# EAGLE design o18_irTransmitter-v03(3_3) (EAGLE 6.6.0)
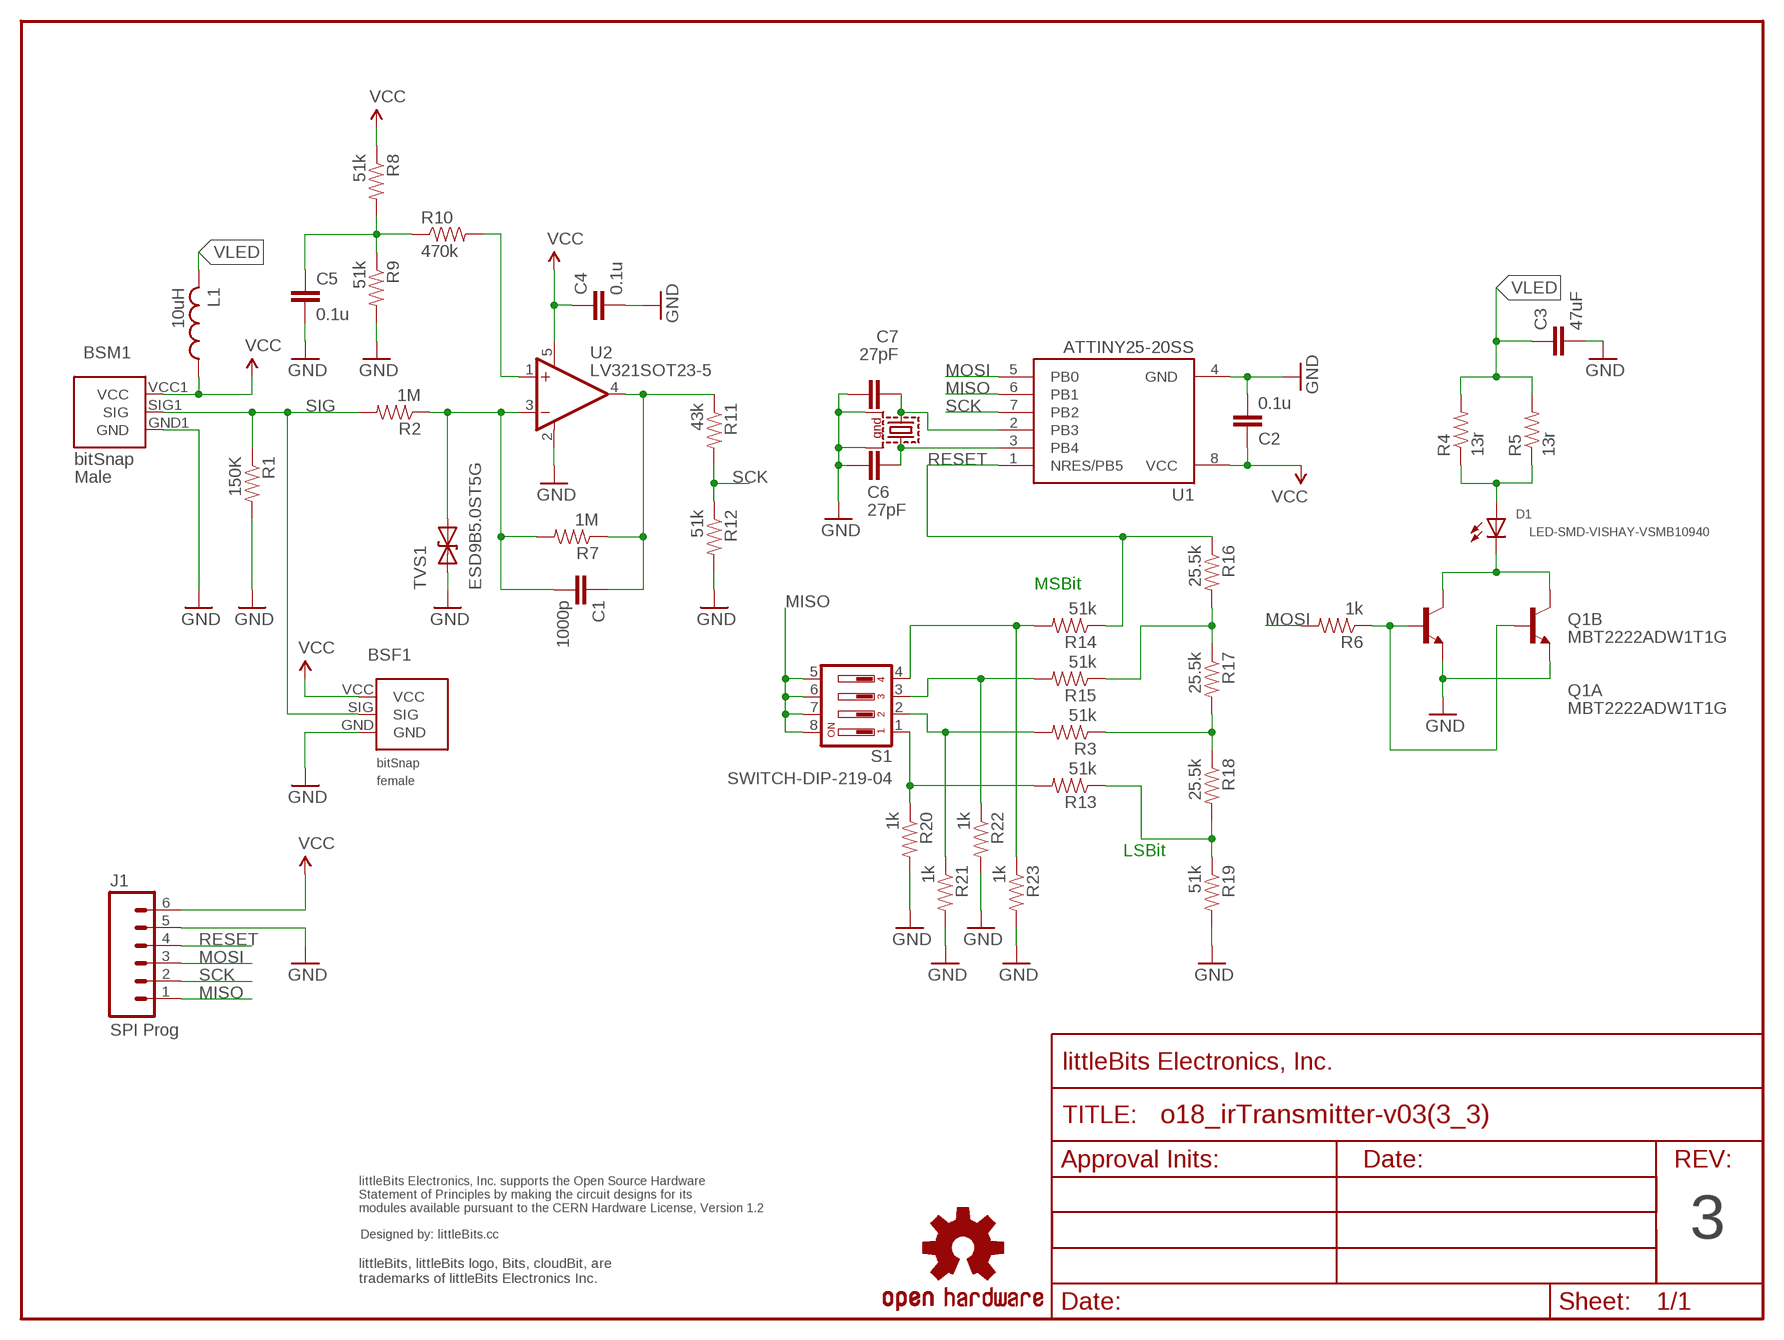
[diagram p0: schematic, sheet 1]

## Parts
BSF1  BITSNAP_V03_FEMALE  [BITSNAP_V03_FEMALE]
BSM1  BITSNAP_V03_MALE  [BITSNAP_V03_MALE]
C1  1000p  CAPCAP-0402  [CAP-0402]
C2  0.1u  CAPCAP-0402  [CAP-0402]
C3  47uF  CAPCAP-1206  [CAP-1206]
C4  0.1u  CAPCAP-0402  [CAP-0402]
C5  0.1u  CAPCAP-0402  [CAP-0402]
C6  27pF  CAPCAP-0402  [CAP-0402]
C7  27pF  CAPCAP-0402  [CAP-0402]
D1  LED-SMD-VISHAY-VSMB10940  [LED-SMD-VISHAY-VSMB10940]
J1  SPI Prog  HRD-60.1INCH_NO_SILKSCREEN_SMALL  [SIP6-SM-0.1IN-NOS.S-MIN]
L1  10uH  INDUCTOR-SMT0805  [IND-0805]
Q1  MBT2222ADW1T1G  TRANS-BJT_NPN-DUAL-MBT2222ADW1T1-D  [SOT-363_ONSEMI]
R1  150K  RESISTOR0402  [RES-0402]
R2  1M  RESISTOR0402  [RES-0402]
R3  51k  RESISTOR0402  [RES-0402]
R4  13r  RESISTOR0603  [RES-0603]
R5  13r  RESISTOR0603  [RES-0603]
R6  1k  RESISTOR0402  [RES-0402]
R7  1M  RESISTOR0402  [RES-0402]
R8  51k  RESISTOR0402  [RES-0402]
R9  51k  RESISTOR0402  [RES-0402]
R10  470k  RESISTOR0402  [RES-0402]
R11  43k  RESISTOR0402  [RES-0402]
R12  51k  RESISTOR0402  [RES-0402]
R13  51k  RESISTOR0402  [RES-0402]
R14  51k  RESISTOR0402  [RES-0402]
R15  51k  RESISTOR0402  [RES-0402]
R16  25.5k  RESISTOR0402  [RES-0402]
R17  25.5k  RESISTOR0402  [RES-0402]
R18  25.5k  RESISTOR0402  [RES-0402]
R19  51k  RESISTOR0402  [RES-0402]
R20  1k  RESISTOR0402  [RES-0402]
R21  1k  RESISTOR0402  [RES-0402]
R22  1k  RESISTOR0402  [RES-0402]
R23  1k  RESISTOR0402  [RES-0402]
S1  SWITCH-DIP-219-04  [CTS-219-04]
TVS1  ESD9B5.0ST5G  DIODE-TVSSOD-923  [SOD-923]
U1  ATTINY25-20SS  [SOIC08_JEDEC_150MIL]
U2  LV321SOT23-5  [SOT23-5]
U$16  OSHWCREDIT  [OSHWCREDIT]
U$26  FRAME-LETTER-OHWOHW  [FABDWG01-OHW]
U$27  OSHW-LOGOL  [OSHW-LOGO-L]
X1  7B-8.000MAAJ-T  CRYSTAL-SMD-7B-SERIES-TXC  [CRYSTAL-SMD-7B-SERIES-5X3.2MM]

## Nets
GND: BSF1.GND BSM1.GND1(GND) C2.2 C3.2 C4.2 C5.2 C6.2 C7.1 J1.5 Q1.1(B:E) Q1.4(A:E) R1.2 R9.2 R12.2 R19.2 R20.2 R21.2 R22.2 R23.2 TVS1.1(A) U1.4(GND) U2.2(V-) X1.P$2 X1.P$4
MISO: J1.1 S1.5 S1.6 S1.7 S1.8 U1.6(PB1)
MOSI: J1.3 R6.2 U1.5(PB0)
N$1: D1.C Q1.3(A:C) Q1.6(B:C)
N$2: Q1.2(B:B) Q1.5(A:B) R6.1
N$3: D1.A R4.1 R5.1
N$4: C1.2 R2.1 R7.2 TVS1.2(C) U2.3(-IN)
N$5: R10.2 U2.1(+IN)
N$6: C5.1 R8.2 R9.1 R10.1
N$7: C1.1 R7.1 R11.1 U2.4(OUT)
N$8: C7.2 U1.2(PB3) X1.P$1
N$9: C6.1 U1.3(PB4) X1.P$3
N$10: R3.2 R21.1 S1.2
N$11: R14.2 R23.1 S1.4
N$12: R15.2 R22.1 S1.3
N$13: R13.2 R20.1 S1.1
N$15: R3.1 R17.2 R18.1
N$16: R13.1 R18.2 R19.1
N$17: R15.1 R16.2 R17.1
RESET: J1.4 R14.1 R16.1 U1.1(NRES/PB5)
SCK: J1.2 R11.2 R12.1 U1.7(PB2)
SIG: BSF1.SIG BSM1.SIG1(SIG) R1.1 R2.2
VCC: BSF1.VCC BSM1.VCC1(VCC) C2.1 C4.1 J1.6 L1.1 R8.1 U1.8(VCC) U2.5(V+)
VLED: C3.1 L1.2 R4.2 R5.2

## Notes on the sheet
- MSBit
- LSBit
- 3

## Library data of the parts
BSF1 = bitSnap:BITSNAP_V03_FEMALE
BSM1 = bitSnap:BITSNAP_V03_MALE
C1-C7 = LITTLEBITS:CAP
D1 = LITTLEBITS:LED-SMD-VISHAY-VSMB10940: SMD side emitting IR LED
J1 = LITTLEBITS:HRD-6
L1 = LITTLEBITS:INDUCTOR-SMT: Standard SMT package inductors
Q1 = LITTLEBITS:TRANS-BJT_NPN-DUAL
R1-R23 = LITTLEBITS:RESISTOR
S1 = LITTLEBITS:SWITCH-DIP-219-04*: Surface Mount DIP Switch Series 219 SMT CTS Electronic Components Sourc: www.ctscorp.com; OC_FARNELL: unknown; OC_NEWARK: unknown
TVS1 = LITTLEBITS:DIODE-TVS: Bidirectional Transient Voltage Suppression Diode: Device conducts in avalanche mode after reaching a part dependent voltage threshold. Used for limiting voltage spikes on ESD sensitive inputs and outputs.; IEC_ESD_PROT0: +/-18kV; LB_PN: ?; MPN: ESD9B5.0ST5G; V_CLAMP: ?; V_OPERATION: 5V
U1 = LITTLEBITS:ATTINY25*: ATMEL ATtiny 25 Packages: P = PDIP 08 30mil S = SOIC 08 EIAJ 208mil SS = SOIC 08 JEDEC 150mil Technologies Note: for complete ordering code (temp. range, finish, tape&reel etc.) see www.atmel.com • Supply Voltage: V = (1.8…5.5)V | [blank] = (2.7…5.5)V • Speed: 10 = 10 MHz | 20 = 20 MHz Author: Dipl.-Ing. FH Rainer Bayer HHN Hochschule Heilbronn (Heilbronn University), rainer.bayer@hs-heilbronn.de Ingenieurbüro ing-rb, mail@ing-rb.de
U2 = LITTLEBITS:LV321
U$16 = LITTLEBITS:OSHWCREDIT
U$26 = LITTLEBITS:FRAME-LETTER-OHW
U$27 = LITTLEBITS:OSHW-LOGO: Open Source Hardware Logo This logo indicates the piece of hardware it is found on incorporates a OSHW license and/or adheres to the definition of open source hardware found here: http://freedomdefined.org/OSHW
X1 = LITTLEBITS:CRYSTAL-SMD-7B-SERIES-TXC; MFG: TXC; MPN: 7B SERIES

## Board
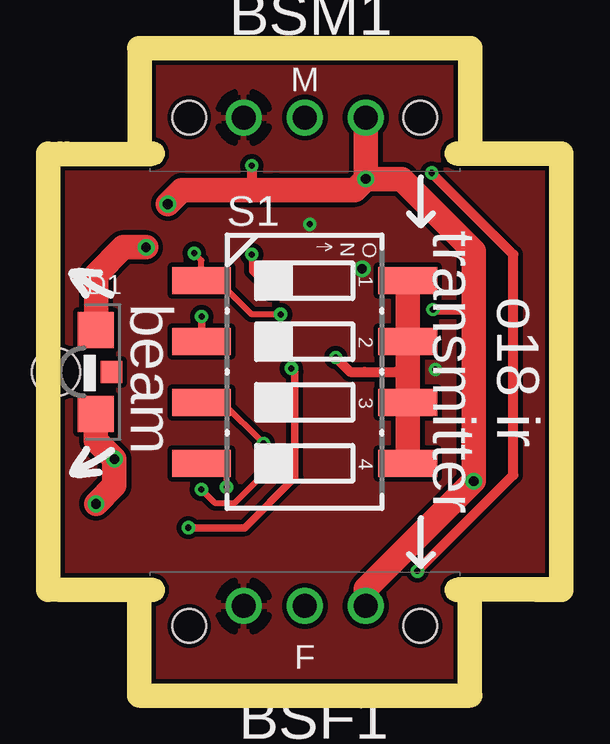
[diagram p1: board, top side]
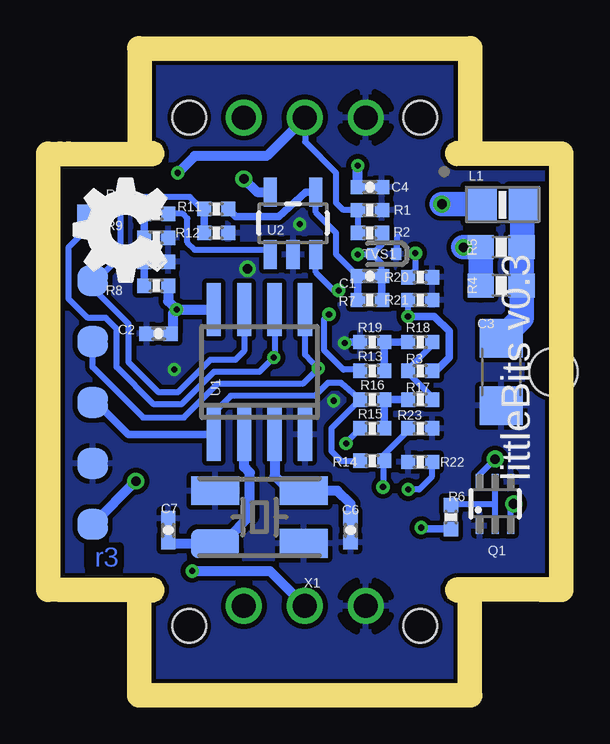
[diagram p2: board, bottom side, seen from below]

Size 20.4 x 26 mm. Coordinates in mm from the lower left corner, seen from the top.
Outline: 20.4,4.4 20.4,21.6
Outline: 0,4.4 0,21.6
Copper layers (1*16): Top 0.035mm / dielectric 1.5mm / Bottom 0.035mm
Design rules "littleBitsDRC": minimum track width 0.2mm, minimum drill 0.4mm, track to track 0.2mm, track to pad 0.2mm, pad to pad 0.2mm, via to via 0.2mm, smd to smd 0mil, copper to edge 0.2mm, drill to drill 0.2mm, minimum pad ring 0.2mm, minimum via ring 0.15mm, stop-mask expansion 0.1mm, vias tented up to drill 0mil, thermal gap 0.2mm
Holes 2 mm at -0.16,12.99
Milling: 6 lines

### Footprints (pad centres in the part's own frame; a part is rotated, then mirrored left to right if it is on the bottom)
BITSNAP_V03_FEMALE = drill 1: GND 4.065,3.44; SIG 6.605,3.44; VCC 9.145,3.44 | hole 1.4: 1.785,2.61; 11.425,2.61
BITSNAP_V03_MALE = drill 1: GND1 9.145,2.61; SIG1 6.605,2.61; VCC1 4.065,2.61 | hole 1.4: 1.785,2.61; 11.425,2.61
CAP-0402 = smd 0.6 x 0.6: 1 -0.5,0; 2 0.5,0
CAP-1206 = smd 1.6 x 1.8: 1 -1.4,0; 2 1.4,0
LED-SMD-VISHAY-VSMB10940 = smd 1.5 x 1.5: A -0.5,-1.75; C -0.5,1.75 | smd 0.9 x 0.9: NC -1.15,0
SIP6-SM-0.1IN-NOS.S-MIN = smd 1.27 x 1.27: 1 -6.35,0; 2 -3.81,0; 3 -1.27,0; 4 1.27,0; 5 3.81,0; 6 6.35,0
IND-0805 = smd 1.3 x 1.5: 1 -0.9,0; 2 0.9,0
SOT-363_ONSEMI = smd 0.3 x 0.66: 1 -0.65,-0.92; 2 0,-0.92; 3 0.65,-0.92; 4 0.65,0.92; 5 0,0.92; 6 -0.65,0.92
RES-0402 = smd 0.6 x 0.6: 1 -0.5,0; 2 0.5,0
RES-0603 = smd 1.1 x 1: 1 -0.85,0; 2 0.85,0
CTS-219-04 = smd 1.13 x 2.44: 1 -3.81,-4.3; 2 -1.27,-4.3; 3 1.27,-4.3; 4 3.81,-4.3; 5 3.81,4.3; 6 1.27,4.3; 7 -1.27,4.3; 8 -3.81,4.3
SOD-923 = smd 0.4 x 0.5: 1 -0.5,0; 2 0.5,0
SOIC08_JEDEC_150MIL = smd 0.6 x 2.2: 1 -1.905,-2.6; 2 -0.635,-2.6; 3 0.635,-2.6; 4 1.905,-2.6; 5 1.905,2.6; 6 0.635,2.6; 7 -0.635,2.6; 8 -1.905,2.6
SOT23-5 = smd 0.55 x 1.2: 1 -0.95,-1.3; 2 0,-1.3; 3 0.95,-1.3; 4 0.95,1.3; 5 -0.95,1.3
CRYSTAL-SMD-7B-SERIES-5X3.2MM = smd 2 x 1.2: P$1 -1.85,-1.1; P$2 1.85,-1.1; P$3 1.85,1.1; P$4 -1.85,1.1

### Placement (x,y rotation side)
BSF1  3.6,-0.21 0 top
BSM1  16.8,26.21 180 top
C1  7.49,16.99 0 bottom
C2  16.29,14.59 180 bottom
C3  2.01,12.99 270 bottom
C4  7.49,20.7 0 bottom
C5  16.39,17.59 0 bottom
C6  8.29,6.39 270 bottom
C7  15.89,6.39 270 bottom
D1  0.99,12.99 180 top
DRILEGEND  [DRILEGEND]  -11.98,-24.53 0 top  (outside the outline)
J1  19.04,12.99 270 bottom
L1  1.96,19.99 0 bottom
Q1  2.27,7.49 0 bottom
R1  7.49,19.74 0 bottom
R2  7.49,18.79 180 bottom
R3  5.39,13.04 0 bottom
R4  2.02,16.59 0 bottom
R5  2.02,18.19 0 bottom
R6  4.11,6.94 270 bottom
R7  7.49,15.99 0 bottom
R8  16.39,16.59 180 bottom
R9  16.39,18.59 0 bottom
R10  16.39,19.59 0 bottom
R11  13.89,19.79 180 bottom
R12  13.89,18.79 0 bottom
R13  7.39,13.04 180 bottom
R14  7.39,9.29 0 bottom
R15  7.39,10.64 180 bottom
R16  7.39,11.84 0 bottom
R17  5.39,11.84 0 bottom
R18  5.39,14.24 180 bottom
R19  7.39,14.24 180 bottom
R20  5.39,16.94 0 bottom
R21  5.39,15.99 0 bottom
R22  5.39,9.24 180 bottom
R23  5.39,10.64 0 bottom
S1  10.19,12.99 270 top
TVS1  6.89,17.91 180 bottom
U1  12.09,12.99 0 bottom
U2  10.69,19.19 0 bottom
U$4  [<]  -0.02,16.63 330 top
U$5  [L]  2.15,15.89 60 top
U$16  -99.03,-63.44 0 top  (outside the outline)
U$20  [OSHW_FILLX150_NOTEXT]  15.99,16.79 90 bottom
U$21  [<]  0.7,8.07 30 top
U$22  [L]  2.42,9.58 120 top
U$26  -3.01,-0.21 0 top  (outside the outline)
U$27  -27.66,-70.23 0 top  (outside the outline)
X1  12.09,6.94 0 bottom

### Tracks (layer width: path | path; a pad name or v marks a point on that pad's centre or on a via)
GND  (via drill 0.25, 0.4)
  Bottom 0.254: TVS1.1 6.34,17.96 6.34,18.64
  Bottom 0.305: R19.2 8.5,14.24 v8.54,14.2
  other vias: 10.41,19.15 8.99,11.79 12.59,17.29 15.64,13.09
  pour Bottom: -1.01,-0.71 21.49,-0.71 21.49,26.79 -1.01,26.79
  pour Top: -0.01,25.79 -0.01,0.04 20.49,0.04 20.49,25.79
MISO  (via drill 0.25)
  Top 0.254: S1.6 14.49,12.99 13.99,12.99
  Top 0.406: v11.49,13.59 12.09,12.99 12.69,12.99 13.99,12.99
  Top 1.016: S1.5 S1.6 S1.7 S1.8
  Bottom 0.254: J1.1 19.04,19.19 20.04,18.19 20.04,16.04 19.24,15.24 18.49,15.24 18.04,14.79 18.04,13.19 16.49,11.64 15.34,11.64 13.99,12.99 12.09,12.99 v11.49,13.59 11.46,13.62 U1.6
MOSI  (via drill 0.25)
  Top 0.305: v5.35,6.5 7.7,6.5 9.79,8.59 9.79,12.99 v9.64,13.14
  Bottom 0.254: U1.5 10.19,13.71 v9.64,13.14 10.29,12.49 13.84,12.49 15.24,11.09 16.94,11.09 19.04,13.19 J1.3
  Bottom 0.305: v5.35,6.5 5.29,6.44 R6.2
N$1  (via drill 0.4)
  Top 1.016: D1.C 1.49,10.14 v2.27,9.36 2.27,8.26 v1.5,7.49
  Bottom 0.254: Q1.3 1.61,7.38 v1.5,7.49 | v2.27,9.36 2.92,8.71 Q1.6
N$2
  Bottom 0.254: Q1.2 2.27,7.49 | 2.27,7.49 Q1.5 | R6.1 4.05,7.49 2.27,7.49
N$3  (via drill 0.4)
  Top 1.016: D1.A 1.5,17.06 2.63,18.19 v3.59,18.19
  Bottom 0.406: R4.1 R5.1
  Bottom 1.016: R4.1 2.87,18.1 2.93,18.16 | R5.1 v3.59,18.19
N$4  (via drill 0.25)
  Top 0.254: v7.99,17.89 7.99,17.19 v8.79,16.39
  Bottom 0.254: R2.1 6.99,18.31 TVS1.2 | TVS1.2 7.41,17.89 v7.99,17.89 | v8.79,16.39 8.99,16.39 9.74,17.14 U2.3 | C1.2 6.99,17.51 TVS1.2
  Bottom 0.305: C1.2 R7.2
N$5
  Bottom 0.254: U2.1 11.84,18.09 14.79,18.09 15.09,18.39 15.09,19.39 15.29,19.59 R10.2
  Bottom 0.305: 11.74,17.99 U2.1
N$6
  Bottom 0.305: R10.1 R9.1 C5.1 R8.2
N$7
  Bottom 0.254: U2.4 9.74,19.64 8.89,18.79 8.89,17.89 C1.1
  Bottom 0.305: R7.1 C1.1 | U2.4 10.17,20.49 11.29,19.47 13.07,19.47 R11.1
N$8
  Bottom 0.254: X1.P$1 14.14,6.04
  Bottom 0.406: C7.2 15.84,5.84 X1.P$1 | 14.14,6.04 13.44,6.04 12.49,6.99 12.49,8.79 12.72,9.02 U1.2
N$9
  Bottom 0.406: C6.1 8.29,7.49 8.84,8.04 X1.P$3 10.29,8.09 10.89,8.09 11.46,8.65 U1.3
N$10  (via drill 0.25)
  Top 0.254: S1.2
  Top 0.305: v5.9,15.3 S1.2
  Bottom 0.254: v5.9,15.3 R21.1
  Bottom 0.305: R3.2 4.75,13.04 4.19,13.6 4.19,14.69 4.8,15.3 v5.9,15.3
N$11  (via drill 0.25)
  Top 0.254: v6.94,8.19 6.94,9.18 S1.4
  Bottom 0.254: R23.1 5.89,10.55 6.89,9.55 R14.2 6.94,9.24 v6.94,8.19
N$12  (via drill 0.25)
  Top 0.254: 6.16,11.45 S1.3 6.77,11.72 v8.48,10.01 8.48,8.73 7.29,7.54 6.44,7.54 v5.89,8.09
  Top 0.305: 6.89,11.45 6.16,11.45
  Bottom 0.254: R15.2 8.48,10.05 v8.48,10.01 | v5.89,8.09 5.44,8.09 4.89,8.64 R22.1
N$13  (via drill 0.25)
  Top 0.254: v9.19,15.39 7.99,15.39 6.79,16.59 6.1,16.59 S1.1 5.89,17.64 v5.59,17.94
  Bottom 0.254: R13.2 7.94,13.09 8.59,13.09 9.39,13.89 9.39,15.19 v9.19,15.39 | v5.59,17.94 5.59,17.24 R20.1
N$15
  Bottom 0.254: R18.1 4.89,14.12 5.89,13.12 R3.1 | 5.89,12.89 R3.1 | R17.2 4.89,11.94 5.89,12.94 R3.1
N$16
  Bottom 0.305: R13.1 R19.1 R18.2
N$17
  Bottom 0.305: R15.1 R16.2 R17.1
RESET
  Bottom 0.254: U1.1 13.99,11.29 13.29,11.99 9.79,11.99 9.24,12.54 8.69,12.54 R16.1 9.09,10.64 9.09,9.69 8.69,9.29 R14.1
  Bottom 0.305: U1.1 17.56,10.39 18.89,11.72 J1.4
SCK
  Bottom 0.254: U1.7 12.72,13.85 13.09,13.49 14.14,13.49 15.49,12.14 16.29,12.14 17.54,13.39 17.54,14.99 19.04,16.49 J1.2 | 18.89,16.49 J1.2 | J1.2 18.89,16.8 17.89,17.8 17.89,20.09 17.69,20.29 14.99,20.29 14.49,19.79 R11.2
  Bottom 0.305: R11.2 R12.1
SIG  (via drill 0.25)
  Top 0.406: v14.89,4.69 18.89,8.69 18.89,17.89 v15.49,21.29
  Bottom 0.254: R2.2 R1.1 8.59,19.74 8.89,20.04 8.89,21.29 10.19,22.59 BSM1.SIG1
  Bottom 0.305: BSM1.SIG1 10.2,23.45
  Bottom 0.406: BSM1.SIG1 10.2,23.58 11.79,21.99 14.79,21.99 v15.49,21.29 | v14.89,4.69 11.66,4.69 BSF1.SIG
VCC  (via drill 0.25, 0.4)
  Top 0.406: 8.89,20.68 8.99,20.58 | v7.99,21.59 7.99,20.58 | v15.54,15.59 17.04,15.59 17.24,15.39
  Top 1.016: BSM1.VCC1 v12.74,21.04 | v4.49,19.99 5.08,20.58 7.99,20.58 8.99,20.58 12.28,20.58 v12.74,21.04 | BSF1.VCC 12.74,3.94 v17.24,8.44 17.24,15.39 17.24,18.04 14.24,21.04 v12.74,21.04
  Bottom 0.305: 13.99,15.19 U1.8
  Bottom 0.406: v12.74,21.04 12.19,20.49 U2.5 | C2.1 15.69,14.69 15.69,15.44 v15.54,15.59 | v15.54,15.59 U1.8 | C4.1 v7.99,21.59 | R8.1 15.89,15.94 v15.54,15.59 | v17.24,8.44 J1.6
  Bottom 1.016: L1.1 v4.49,19.99
VLED
  Bottom 0.406: R5.2 R4.2
  Bottom 1.016: L1.2 1.14,19.91 R4.2 1.17,15.23 C3.1

### Text on the board
Bottom: r3
tPlace: beam | o18 ir / transmitter
bPlace: littleBits v0.3
tNames: BSM1 | D1 | BSF1
tValues: XZFVG10C2
bValues: Miso | Sck | Mosi | Reset | Gnd | VCC
Milling: 1MM ROUTER PATH
Reference: XLARGE
dxf: 3 | Infrared Transmitter
DrillLegend: LAYER-STACK
DrillLegend_01-16: 01-16
DrillLegend_01-20: 01-20